# Altium schematic sheet Main.SchDoc
size A4; SheetNumber: 1; SheetTotal: 1
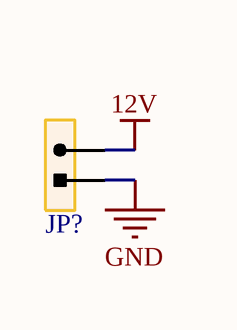
[diagram p0: Main.SchDoc]

## Parts
JP?  HDR-1X2  [KF2EDGK-2P_H_5.08]  (value not drawn)

## Nets
12V: JP?.2
GND: JP?.1

## Library data of the parts
JP? = Header 2: 2P Connector; BOM名称: 2P接插件; 版权归属: 源创客; 学习资源: www.ooocke.com